# Altium schematic sheet AUDIO.SchDoc: Audio Codec and Microphone MEMS
size A4; Date: 01-DEC-2013; Author: A.B; CompanyName: STMicroelectronics; Organization: Microcontrollers Division; Address1: 12, Rue Jules HOROWITZ; Address2: 38019 Grenoble; Address3: FRANCE; DocumentNumber: MB1184; Revision: C-01; SheetNumber: 8; SheetTotal: 10; Project: STM32L476G-DISCO
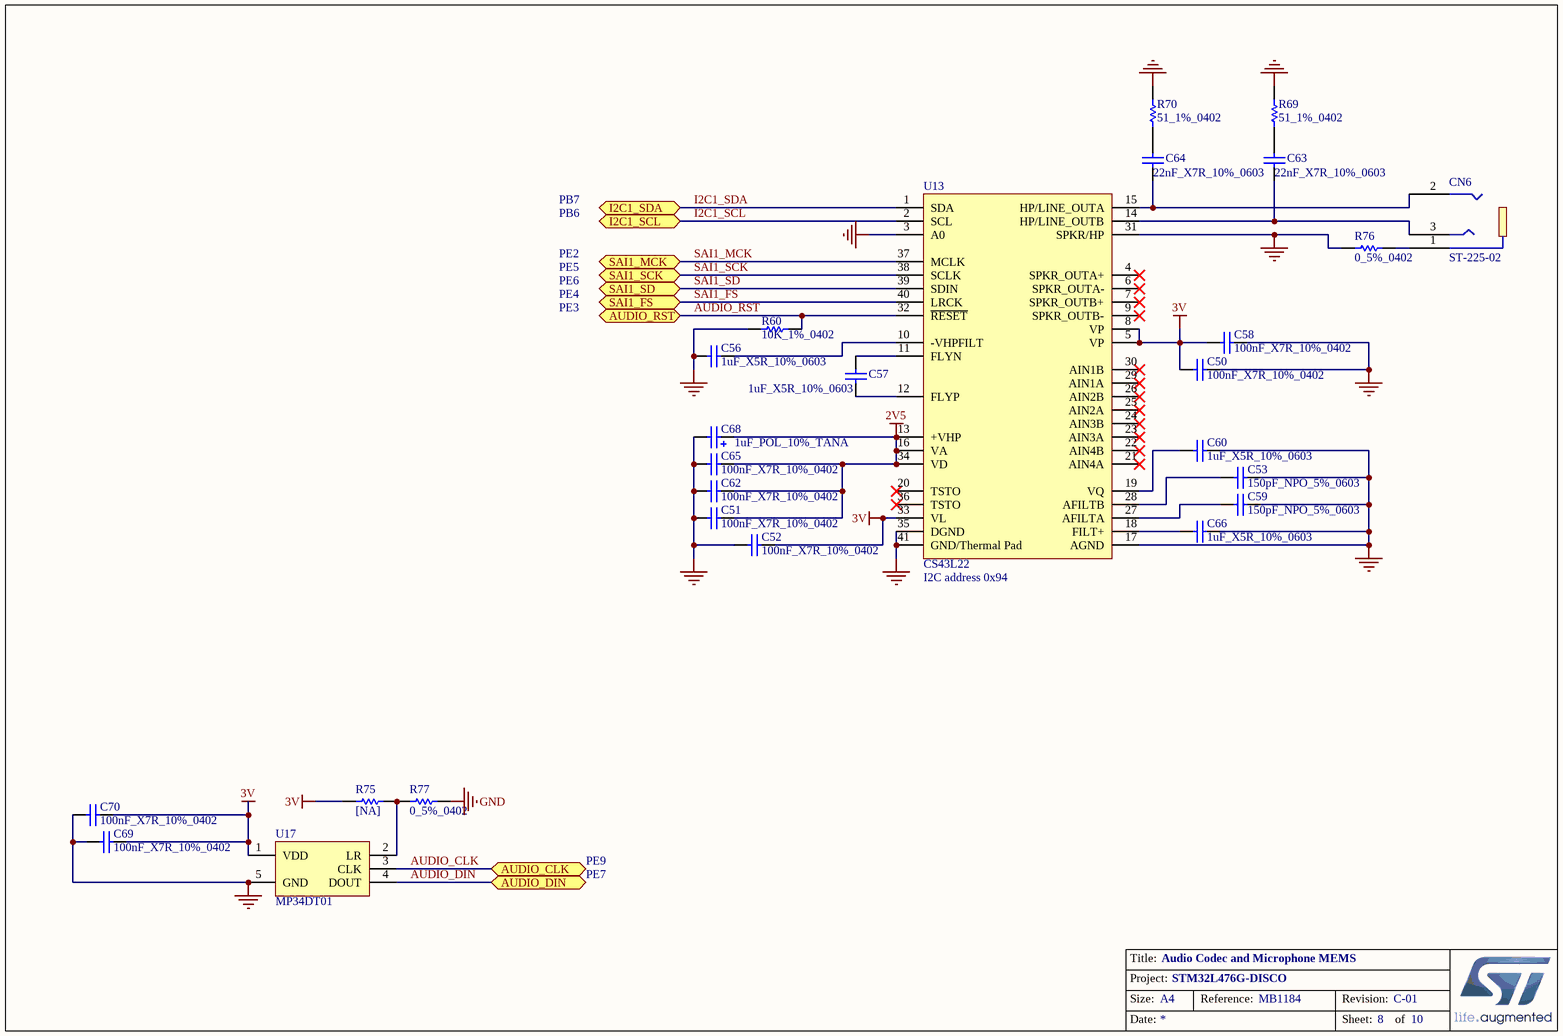
[diagram p0: AUDIO.SchDoc]

## Parts
C50  100nF_X7R_10%_0402  [0402C]
C51  100nF_X7R_10%_0402  [0402C]
C52  100nF_X7R_10%_0402  [0402C]
C53  150pF_NPO_5%_0603  [0603C]
C56  1uF_X5R_10%_0603  [0603C]
C57  1uF_X5R_10%_0603  [0603C]
C58  100nF_X7R_10%_0402  [0402C]
C59  150pF_NPO_5%_0603  [0603C]
C60  1uF_X5R_10%_0603  [0603C]
C62  100nF_X7R_10%_0402  [0402C]
C63  22nF_X7R_10%_0603  [0603C]
C64  22nF_X7R_10%_0603  [0603C]
C65  100nF_X7R_10%_0402  [0402C]
C66  1uF_X5R_10%_0603  [0603C]
C68  1uF_POL_10%_TANA  [TAN-A]
C69  100nF_X7R_10%_0402  [0402C]
C70  100nF_X7R_10%_0402  [0402C]
CN6  ST-225-02  [Jack-ST-225]
R60  10K_1%_0402  [0402R]
R69  51_1%_0402  [0402R]
R70  51_1%_0402  [0402R]
R75  [NA]  [0402R]
R76  0_5%_0402  [0402R]
R77  0_5%_0402  [0402R]
U13  CS43L22  [QFN40_6x6]
U17  MP34DT01  [HCLGA4_3X4]

## Ports
AUDIO_CLK, AUDIO_DIN, AUDIO_RST, I2C1_SCL, I2C1_SDA, SAI1_FS, SAI1_MCK, SAI1_SCK, SAI1_SD

## Nets
2V5: C51.2 C62.2 C65.2 C68.1 U13.13(+VHP) U13.16(VA) U13.34(VD)
3V: C50.1 C52.2 C58.1 C69.2 C70.2 R75.2 U13.5(VP) U13.8(VP) U13.33(VL) U17.1(VDD)
GND: C50.2 C51.1 C52.1 C53.2 C56.1 C58.2 C59.2 C60.2 C62.1 C65.1 C66.2 C68.2 C69.1 C70.1 R60.1 R69.2 R70.2 R76.1 R77.1 U13.3(A0) U13.17(AGND) U13.31(SPKR/HP) U13.35(DGND) U13.41(GND/Thermal_Pad) U17.5(GND)
AUDIO_CLK: U17.3(CLK) ; port AUDIO_CLK
AUDIO_DIN: U17.4(DOUT) ; port AUDIO_DIN
AUDIO_RST: R60.2 U13.32(~{RESET}) ; port AUDIO_RST
I2C1_SCL: U13.2(SCL) ; port I2C1_SCL
I2C1_SDA: U13.1(SDA) ; port I2C1_SDA
SAI1_FS: U13.40(LRCK) ; port SAI1_FS
SAI1_MCK: U13.37(MCLK) ; port SAI1_MCK
SAI1_SCK: U13.38(SCLK) ; port SAI1_SCK
SAI1_SD: U13.39(SDIN) ; port SAI1_SD
NetC53_1: C53.1 U13.28(AFILTB)
NetC56_2: C56.2 U13.10(-VHPFILT)
NetC57_1: C57.1 U13.12(FLYP)
NetC57_2: C57.2 U13.11(FLYN)
NetC59_1: C59.1 U13.27(AFILTA)
NetC60_1: C60.1 U13.19(VQ)
NetC63_1: C63.1 CN6.3 U13.14(HP/LINE_OUTB)
NetC63_2: C63.2 R69.1
NetC64_1: C64.1 CN6.2 U13.15(HP/LINE_OUTA)
NetC64_2: C64.2 R70.1
NetC66_1: C66.1 U13.18(FILT+)
NetCN6_1: CN6.1 R76.2
NetR75_1: R75.1 R77.2 U17.2(LR)

Not connected (* = marked no-connect by the designer): U13 4(SPKR_OUTA+)* 6(SPKR_OUTA-)* 7(SPKR_OUTB+)* 9(SPKR_OUTB-)* 20(TSTO)* 21(AIN4A)* 22(AIN4B)* 23(AIN3A)* 24(AIN3B)* 25(AIN2A)* 26(AIN2B)* 29(AIN1A)* 30(AIN1B)* 36(TSTO)*

## Notes on the sheet
- PB7
- PB6
- PE3
- PE2
- PE4
- PE5
- PE6
- (near U13) I2C address 0x94
- PE9
- PE7
- Title:
- Project:
- Size:
- Date:
- A4
- Reference:
- Sheet:
- Revision:
- of

## Library data of the parts
C50-C52 C58 C62 C65 C69 C70 = Cap_100nF_X7R_10%_0402: Capacitor,100nF,16V,X7R,10%,0402,YAGEO; Manuf_Part_1: CC0402KRX7R7BB104; Revision: July-2002: Re-released for DXP Platform.; Value: 100nF; Order: CC0402KRX7R7BB104; Manuf_1: YAGEO; ECCN_US/EU: n/a
C53 C59 = Cap_150pF_NPO_5%_0603: Capacitor,150pF,50V,NPO,5%,0603,YAGEO; Order: CC0603JRNPO9BN151; Revision: July-2002: Re-released for DXP Platform.; Value: 150pF; Manuf_1: YAGEO; Manuf_Part_1: CC0603JRNPO9BN151; ECCN_US/EU: n/a
C56 C57 C60 C66 = Cap_1uF_X5R_10%_0603: Capacitor,1uF,16V,X5R,10%,0603,YAGEO; Manuf_Part_1: CC0603KRX5R7BB105; Revision: July-2002: Re-released for DXP Platform.; Value: 1uF; Order: CC0603KRX5R7BB105; Manuf_1: YAGEO; ECCN_US/EU: n/a
C63 C64 = Cap_22nF_X7R_10%_0603: Capacitor,22nF,50V,X7R,10%,0603,YAGEO; Manuf_Part_1: CC0603KRX7R9BB223; Revision: July-2002: Re-released for DXP Platform.; Value: 22nF; Order: CC0603KRX7R9BB223; Manuf_1: YAGEO; ECCN_US/EU: n/a
C68 = Cap_1uF_POL_10%_TANA: Polarized Capacitor,1uF,16V,10%,typeA,AVX; Manuf_Part_1: TAJA105K016R; Revision: July-2002: Re-released for DXP Platform.; Value: 1uF; Manuf_1: AVX; Distrib: *; Order: TAJA105K016R; ECCN_US/EU: n/a
CN6 = ST-225-02: Connector Jack 3.5mm; Manuf_1: XIEJIA Electronics; Order: ST-225-02; Manuf_Part_1: ST-225-02; Distrib: Jiubaba; ECCN_US/EU: n/a
R60 = Res_10K_1%_0402: Resistor,10K,0402,1%,YAGEO; Manuf_Part_1: RC0402FR-0710KL; Value: 10K; Manuf_1: YAGEO; Order: RC0402FR-0710KL; ECCN_US/EU: n/a
R69 R70 = Res_51_1%_0402: Resistor,51,0402,1%,YAGEO; Manuf_Part_1: RC0402FR-0751RL; Value: 51; Order: 311-51.0LRTR-ND; Manuf_1: YAGEO; ECCN_US/EU: n/a; Distrib: DIGIKEY
R75 = Res_NA_0402: Resistor,[NA],0402; Fitted: NO; Value: [NA]; ECCN_US/EU: n/a
R76 R77 = Res_0_5%_0402: Resistor,0,0402,5%,YAGEO; Manuf_Part_1: RC0402JR-070RL; Value: 0; Order: 2363467; ECCN_US/EU: n/a; Manuf_1: YAGEO; Distrib: FARNELL
U13 = CS43L22: Low Power, Stereo DAC w/Headphone & Speaker Amps; Manuf_1: Cirrus; Order: CS43L22-CNZ; ECCN_US/EU: EAR99/NEC; Manuf_Part_1: CS43L22-CNZ; Distrib: DIGIKEY
U17 = MP34DT01: MEMS audio sensor, omnidirectional digital microphone; Manuf_1: STM; Manuf_Part_1: MP34DT01TR; Provided: ST; Ref St: 9188008; ECCN_US/EU: EAR99/NEC; Order: MP34DT01TR; Distrib: ST